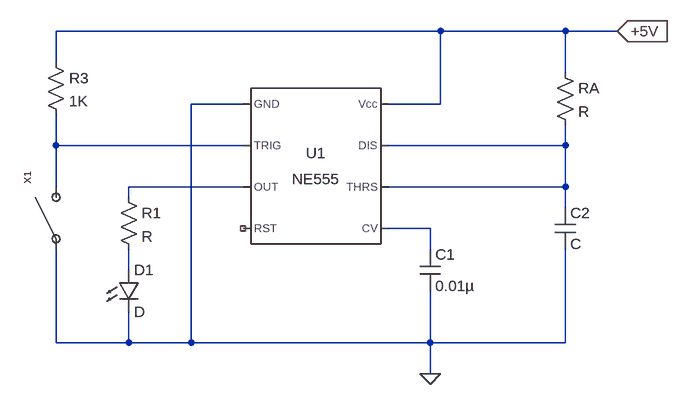
[diagram p0: schematic Blinky.asc]
Blinky.asc, the LTspice schematic file:
Version 4
SHEET 1 880 680
WIRE 400 -32 -192 -32
WIRE 592 -32 400 -32
WIRE 672 -32 592 -32
WIRE -192 16 -192 -32
WIRE 592 32 592 -32
WIRE 96 80 16 80
WIRE 400 80 400 -32
WIRE 400 80 320 80
WIRE -192 144 -192 96
WIRE 96 144 -192 144
WIRE 592 144 592 112
WIRE 592 144 320 144
WIRE -192 208 -192 144
WIRE 96 208 -80 208
WIRE 592 208 592 144
WIRE 592 208 320 208
WIRE -80 224 -80 208
WIRE 592 240 592 208
WIRE 384 272 320 272
WIRE 384 304 384 272
WIRE -80 336 -80 304
WIRE -192 448 -192 304
WIRE -80 448 -80 400
WIRE -80 448 -192 448
WIRE 16 448 16 80
WIRE 16 448 -80 448
WIRE 384 448 384 368
WIRE 384 448 16 448
WIRE 592 448 592 304
WIRE 592 448 384 448
WIRE 384 496 384 448
FLAG 672 -32 +5V
IOPIN 672 -32 In
FLAG 384 496 0
SYMBOL Misc\\NE555 208 176 R0
SYMATTR InstName U1
SYMBOL cap 368 304 R0
SYMATTR InstName C1
SYMATTR Value 0.01µ
SYMATTR SpiceLine V=16 Irms=648m Rser=0.395426 Lser=0 mfg="KEMET" pn="C0402C103K4PAC" type="X5R"
SYMBOL res 576 16 R0
SYMATTR InstName RA
SYMBOL cap 576 240 R0
SYMATTR InstName C2
SYMBOL res -96 208 R0
SYMATTR InstName R1
SYMBOL LED -96 336 R0
SYMATTR InstName D1
SYMBOL res -208 0 R0
SYMATTR InstName R3
SYMATTR Value 1K
SYMATTR SpiceLine tol=1 pwr=0.1
SYMBOL SPST -208 256 R270
SYMATTR InstName X1

The netlist it stands for:
* Blinky.asc
XU1 0 N001 N003 NC_01 N004 N002 N002 +5V NE555  ; pins GND TRIG OUT RST CV THRS DIS Vcc
C1 N004 0 0.01µ V=16 Irms=648m Rser=0.395426 Lser=0 mfg="KEMET" pn="C0402C103K4PAC" type="X5R"
RA +5V N002 R
C2 N002 0 C
R1 N003 N005 R
D1 N005 0 D
R3 +5V N001 1K tol=1 pwr=0.1
XX1 0 N001 SPST
.model D D
.lib standard.dio
.lib NE555.sub
.backanno
.end